# EAGLE schematic isoHV_2channel v0.7 (EAGLE 9.4.2)
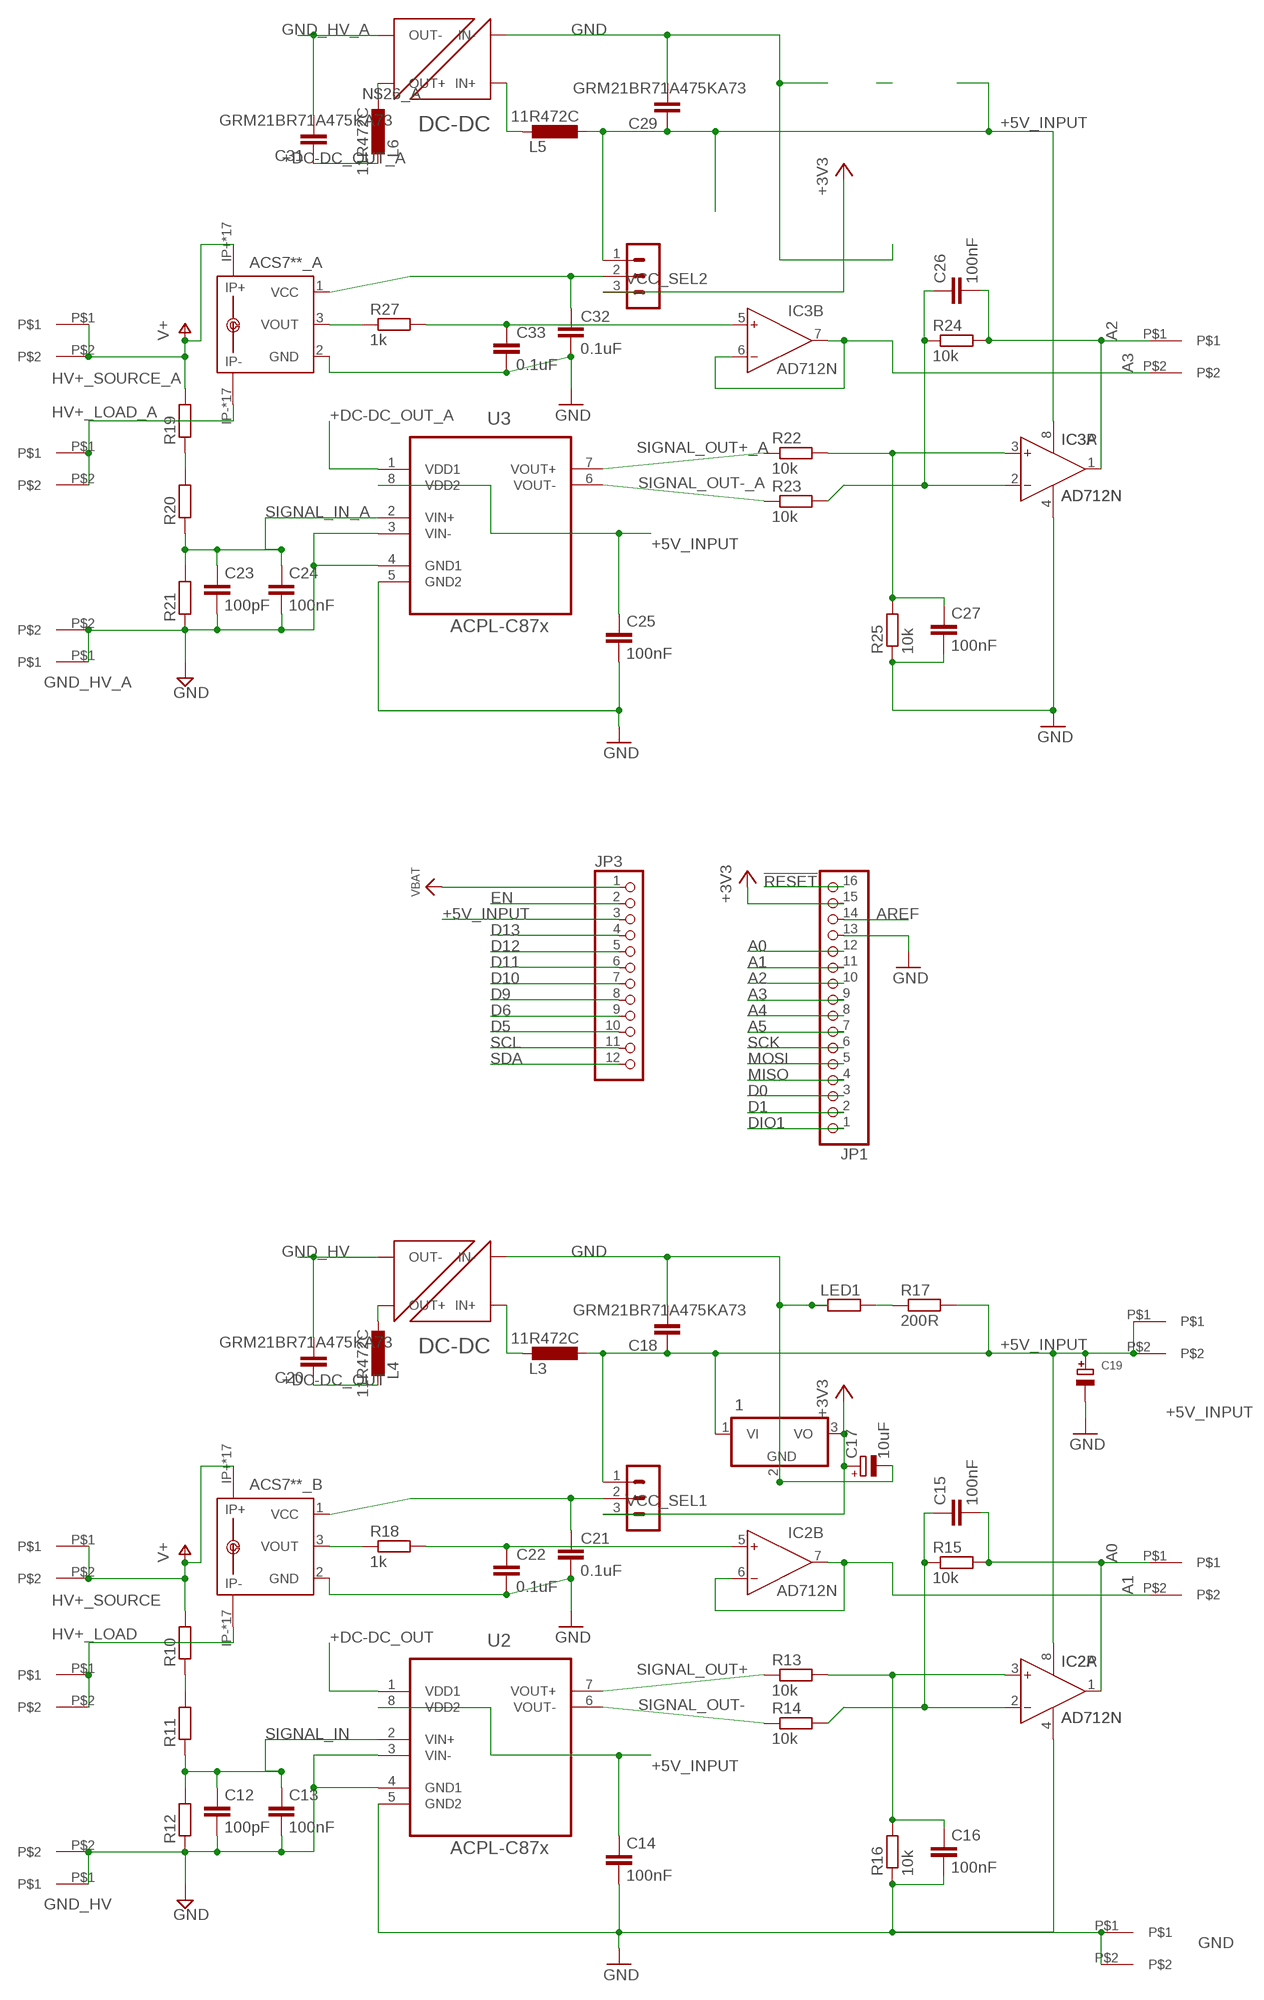
[diagram p0: schematic, sheet 1]

## Parts
1  7805TV  [TO220V]
ACS7**_A  ACS758KCB-150B-PFF-T  [CB-PFF]
ACS7**_B  ACS758KCB-150B-PFF-T  [CB-PFF]
C12  100pF  C-EU025-025X050  [C025-025X050]
C13  100nF  C-EU025-025X050  [C025-025X050]
C14  100nF  C-EU025-025X050  [C025-025X050]
C15  100nF  C-EU025-025X050  [C025-025X050]
C16  100nF  C-EU025-025X050  [C025-025X050]
C17  10uF  CPOL-EUB45181A  [B45181A]
C18  GRM21BR71A475KA73  C-EU025-025X050  [C025-025X050]
C19  CAP_ELECTROLYTICPTH_3.5MMGRID_10MMDIA  [CELEC_3.5MM_10MM]
C20  GRM21BR71A475KA73  C-EU025-050X050  [C025-050X050]
C21  0.1uF  C-EU025-025X050  [C025-025X050]
C22  0.1uF  C-EU025-025X050  [C025-025X050]
C23  100pF  C-EU025-025X050  [C025-025X050]
C24  100nF  C-EU025-025X050  [C025-025X050]
C25  100nF  C-EU025-025X050  [C025-025X050]
C26  100nF  C-EU025-025X050  [C025-025X050]
C27  100nF  C-EU025-025X050  [C025-025X050]
C29  GRM21BR71A475KA73  C-EU025-025X050  [C025-025X050]
C31  GRM21BR71A475KA73  C-EU025-050X050  [C025-050X050]
C32  0.1uF  C-EU025-025X050  [C025-025X050]
C33  0.1uF  C-EU025-025X050  [C025-025X050]
IC2  AD712N  [DIL08]
IC3  AD712N  [DIL08]
JP1  HEADER-1X16ROUND  [1X16_ROUND]
JP3  HEADER-1X12  [1X12_ROUND]
L3  11R472C  L-EU0204V  [0204V]
L4  11R472C  L-EU0204V  [0204V]
L5  11R472C  L-EU0204V  [0204V]
L6  11R472C  L-EU0204V  [0204V]
LED1  R-EU_0204/2V  [0204V]
R10  R-EU_0411/15  [0411/15]
R11  R-EU_0411/15  [0411/15]
R12  R-EU_0411/15  [0411/15]
R13  10k  R-EU_0204/7  [0204/7]
R14  10k  R-EU_0204/7  [0204/7]
R15  10k  R-EU_0204/7  [0204/7]
R16  10k  R-EU_0204/7  [0204/7]
R17  200R  R-EU_0204/2V  [0204V]
R18  1k  R-EU_0204/7  [0204/7]
R19  R-EU_0411/15  [0411/15]
R20  R-EU_0411/15  [0411/15]
R21  R-EU_0411/15  [0411/15]
R22  10k  R-EU_0204/7  [0204/7]
R23  10k  R-EU_0204/7  [0204/7]
R24  10k  R-EU_0204/7  [0204/7]
R25  10k  R-EU_0204/7  [0204/7]
R27  1k  R-EU_0204/7  [0204/7]
U2  ACPL-C87x  ACPL-C79B-000E  [SOIC127P1150X330-8N]
U3  ACPL-C87x  ACPL-C79B-000E  [SOIC127P1150X330-8N]
U$8  7.62MM_TERMINAL_BLOCK  [7.62MM]
U$9  7.62MM_TERMINAL_BLOCK  [7.62MM]
U$10  7.62MM_TERMINAL_BLOCK  [7.62MM]
U$14  7.62MM_TERMINAL_BLOCK  [7.62MM]
U$15  7.62MM_TERMINAL_BLOCK  [7.62MM]
U$16  7.62MM_TERMINAL_BLOCK  [7.62MM]
U$17  NXF1  [NXF1]
U$21  7.62MM_TERMINAL_BLOCK  [7.62MM]
U$22  7.62MM_TERMINAL_BLOCK  [7.62MM]
U$25  7.62MM_TERMINAL_BLOCK  [7.62MM]
U$26  7.62MM_TERMINAL_BLOCK  [7.62MM]
U$27  NXF1  [NXF1]
VCC_SEL1  MA03-1  [MA03-1]
VCC_SEL2  MA03-1  [MA03-1]

## Nets
!RESET: JP1.16
+3V3: 1.3(VO) C17.+ JP1.15 VCC_SEL1.3 VCC_SEL2.3
+5V_INPUT [5v]: 1.1(VI) C14.1 C18.1 C19.+ C25.1 C29.1 IC2.8(P:V+) IC3.8(P:V+) JP3.3 L3.2 L5.2 R17.2 U2.8(VDD2) U3.8(VDD2) U$10.P$1 U$10.P$2 VCC_SEL1.1 VCC_SEL2.1
+DC-DC_OUT: C20.1 L4.1 U2.1(VDD1)
+DC-DC_OUT_A: C31.1 L6.1 U3.1(VDD1)
A0: C15.2 IC2.1(A:OUT) JP1.12 R15.2 U$15.P$1
A1: IC2.6(B:IN-) IC2.7(B:OUT) JP1.11 U$15.P$2
A2: C26.2 IC3.1(A:OUT) JP1.10 R24.2 U$25.P$1
A3: IC3.6(B:IN-) IC3.7(B:OUT) JP1.9 U$25.P$2
A4: JP1.8
A5: JP1.7
AREF: JP1.14
D0: JP1.3
D1: JP1.2
D5: JP3.10
D6: JP3.9
D9: JP3.8
D10: JP3.7
D11: JP3.6
D12: JP3.5
D13: JP3.4
DIO1: JP1.1
EN: JP3.2
GND: 1.2(GND) ACS7**_A.2(GND) ACS7**_B.2(GND) C14.2 C16.2 C17.- C18.2 C19.- C21.2 C22.2 C25.2 C27.2 C29.2 C32.2 C33.2 IC2.4(P:V-) IC3.4(P:V-) JP1.13 LED1.1 R16.1 R25.1 U2.5(GND2) U3.5(GND2) U$14.P$1 U$14.P$2 U$17.P$1(IN-) U$27.P$1(IN-)
GND_HV: C12.2 C13.2 C20.2 R12.1 U2.3(VIN-) U2.4(GND1) U$9.P$1 U$9.P$2 U$17.P$7(OUT-) ; supply symbol labelled GND
GND_HV_A: C23.2 C24.2 C31.2 R21.1 U3.3(VIN-) U3.4(GND1) U$22.P$1 U$22.P$2 U$27.P$7(OUT-) ; supply symbol labelled GND
HV+_LOAD: ACS7**_B.IP- ACS7**_B.IP-@2(IP-) ACS7**_B.IP-@3(IP-) ACS7**_B.IP-@4(IP-) ACS7**_B.IP-@5(IP-) ACS7**_B.IP-@6(IP-) ACS7**_B.IP-@7(IP-) ACS7**_B.IP-@8(IP-) ACS7**_B.IP-@9(IP-) ACS7**_B.IP-@10(IP-) ACS7**_B.IP-@11(IP-) ACS7**_B.IP-@12(IP-) ACS7**_B.IP-@13(IP-) ACS7**_B.IP-@14(IP-) ACS7**_B.IP-@15(IP-) ACS7**_B.IP-@16(IP-) ACS7**_B.IP-@17(IP-) U$16.P$1 U$16.P$2
HV+_LOAD_A: ACS7**_A.IP- ACS7**_A.IP-@2(IP-) ACS7**_A.IP-@3(IP-) ACS7**_A.IP-@4(IP-) ACS7**_A.IP-@5(IP-) ACS7**_A.IP-@6(IP-) ACS7**_A.IP-@7(IP-) ACS7**_A.IP-@8(IP-) ACS7**_A.IP-@9(IP-) ACS7**_A.IP-@10(IP-) ACS7**_A.IP-@11(IP-) ACS7**_A.IP-@12(IP-) ACS7**_A.IP-@13(IP-) ACS7**_A.IP-@14(IP-) ACS7**_A.IP-@15(IP-) ACS7**_A.IP-@16(IP-) ACS7**_A.IP-@17(IP-) U$26.P$1 U$26.P$2
HV+_SOURCE: ACS7**_B.IP+ ACS7**_B.IP+@2(IP+) ACS7**_B.IP+@3(IP+) ACS7**_B.IP+@4(IP+) ACS7**_B.IP+@5(IP+) ACS7**_B.IP+@6(IP+) ACS7**_B.IP+@7(IP+) ACS7**_B.IP+@8(IP+) ACS7**_B.IP+@9(IP+) ACS7**_B.IP+@10(IP+) ACS7**_B.IP+@11(IP+) ACS7**_B.IP+@12(IP+) ACS7**_B.IP+@13(IP+) ACS7**_B.IP+@14(IP+) ACS7**_B.IP+@15(IP+) ACS7**_B.IP+@16(IP+) ACS7**_B.IP+@17(IP+) R10.2 U$8.P$1 U$8.P$2 ; supply symbol labelled V+
HV+_SOURCE_A: ACS7**_A.IP+ ACS7**_A.IP+@2(IP+) ACS7**_A.IP+@3(IP+) ACS7**_A.IP+@4(IP+) ACS7**_A.IP+@5(IP+) ACS7**_A.IP+@6(IP+) ACS7**_A.IP+@7(IP+) ACS7**_A.IP+@8(IP+) ACS7**_A.IP+@9(IP+) ACS7**_A.IP+@10(IP+) ACS7**_A.IP+@11(IP+) ACS7**_A.IP+@12(IP+) ACS7**_A.IP+@13(IP+) ACS7**_A.IP+@14(IP+) ACS7**_A.IP+@15(IP+) ACS7**_A.IP+@16(IP+) ACS7**_A.IP+@17(IP+) R19.2 U$21.P$1 U$21.P$2 ; supply symbol labelled V+
MISO: JP1.4
MOSI: JP1.5
N$10: R10.1 R11.2
N$11: C16.1 IC2.3(A:IN+) R13.2 R16.2
N$12: C15.1 IC2.2(A:IN-) R14.2 R15.1
N$13: ACS7**_B.1(VCC) C21.1 VCC_SEL1.2
N$14: C22.1 IC2.5(B:IN+) R18.2
N$15: LED1.2 R17.1
N$16: L3.1 U$17.P$3(IN+)
N$17: L4.2 U$17.P$8(OUT+)
N$18: ACS7**_B.3(VOUT) R18.1
N$19_A: R19.1 R20.2
N$20: C27.1 IC3.3(A:IN+) R22.2 R25.2
N$21: C26.1 IC3.2(A:IN-) R23.2 R24.1
N$22: ACS7**_A.1(VCC) C32.1 VCC_SEL2.2
N$23: C33.1 IC3.5(B:IN+) R27.2
N$25: L5.1 U$27.P$3(IN+)
N$26_A: L6.2 U$27.P$8(OUT+)
N$27: ACS7**_A.3(VOUT) R27.1
SCK: JP1.6
SCL: JP3.11
SDA: JP3.12
SIGNAL_IN: C12.1 C13.1 R11.1 R12.2 U2.2(VIN+)
SIGNAL_IN_A: C23.1 C24.1 R20.1 R21.2 U3.2(VIN+)
SIGNAL_OUT+: R13.1 U2.7(VOUT+)
SIGNAL_OUT+_A: R22.1 U3.7(VOUT+)
SIGNAL_OUT-: R14.1 U2.6(VOUT-)
SIGNAL_OUT-_A: R23.1 U3.6(VOUT-)
VBAT: JP3.1

## Library data of the parts
1 = linear:78*: Positive VOLTAGE REGULATOR Source: http://cache.national.com/ds/LM/LM78L05.pdf http://www.fairchildsemi.com/ds/LM/LM7805.pdf
ACS7**_A ACS7**_B = allegro:ACS758*: Thermally Enhanced, Fully Integrated, Hall Effect-Based Linear Current Sensor with 100 micro Ohm Current Conductor display layer 49 Reference in BRD and place VIAs on circles Source: http://www.allegromicro.com/en/Products/Part_Numbers/0758/0758.pdf; MPN: ACS7**; OC_FARNELL: 1718995; OC_NEWARK: 04R7129
C12-C16 C18 C20-C27 C29 C31-C33 = rcl:C-EU: CAPACITOR, European symbol; SPICEPREFIX: C
C17 = rcl:CPOL-EU: POLARIZED CAPACITOR, European symbol; SPICEPREFIX: C
C19 = microbuilder:CAP_ELECTROLYTIC: Electrolytic Capacitors SMT PANASONIC_C - Size C Panasonic Electrolytic Aluminum Capacitor 47µF 16V 20% Electrolytic Capacitor [Digikey: PCE3890TR-ND] PANASONIC_D - Size D Panasonic Electrolytic Aluminum Capacitor 100µF 25V 20% Electrolytic Capacitor [Digikey: PCE3898TR-ND] PTH 3.5 mm grid, 8 mm diameter ... 3.5 mm grid, 10 mm diameter ...
IC2 IC3 = analog-devices:AD712: Dual Precision, Low Cost, High Speed BiFET Op Amp Source: http://www.analog.com/static/imported-files/data_sheets/AD712.pdf; MF: ALTERA CORPORATION; MPN: AD712JNZ; OC_FARNELL: 9604898; OC_NEWARK: 59K4554
JP1 = microbuilder:HEADER-1X16: PIN HEADER
JP3 = microbuilder:HEADER-1X12
L3-L6 = rcl:L-EU: INDUCTOR, European symbol; SPICEPREFIX: L
LED1 R10-R25 R27 = rcl:R-EU_: RESISTOR, European symbol; SPICEPREFIX: R
U2 U3 = Avago_By_element14_Batch_1:ACPL-C79B-000E: Precision Miniature Isolation Amplifiers; DESCRIPTION: Precision Miniature Isolation Amplifiers; MPN: ACPL-C79B-000E; OC_FARNELL: 1854253; OC_NEWARK: 74R5803; PACKAGE: SOIC-8; SUPPLIER: AVAGO TECHNOLOGIES
U$8-U$10 U$14-U$16 U$21 U$22 U$25 U$26 = 7.62mm terminal block:7.62MM_TERMINAL_BLOCK
U$17 U$27 = NXF1:NXF1
VCC_SEL1 VCC_SEL2 = con-lstb:MA03-1: PIN HEADER; OC_FARNELL: unknown; OC_NEWARK: unknown

## Net classes
0 default: width 0.254 mm, drill 0.254 mm, clearance 0.254 mm
1 5v: width 0.406 mm, drill 0.254 mm, clearance 0.254 mm